# Altium schematic sheet PicoZed.SchDoc
size A4; Organization: Altium Limited; Address1: L3, 12a Rodborough Rd; Address2: Frenchs Forest; Address3: NSW; Address4: Australia 2086; DocumentNumber: 2; SheetNumber: 2; SheetTotal: 2
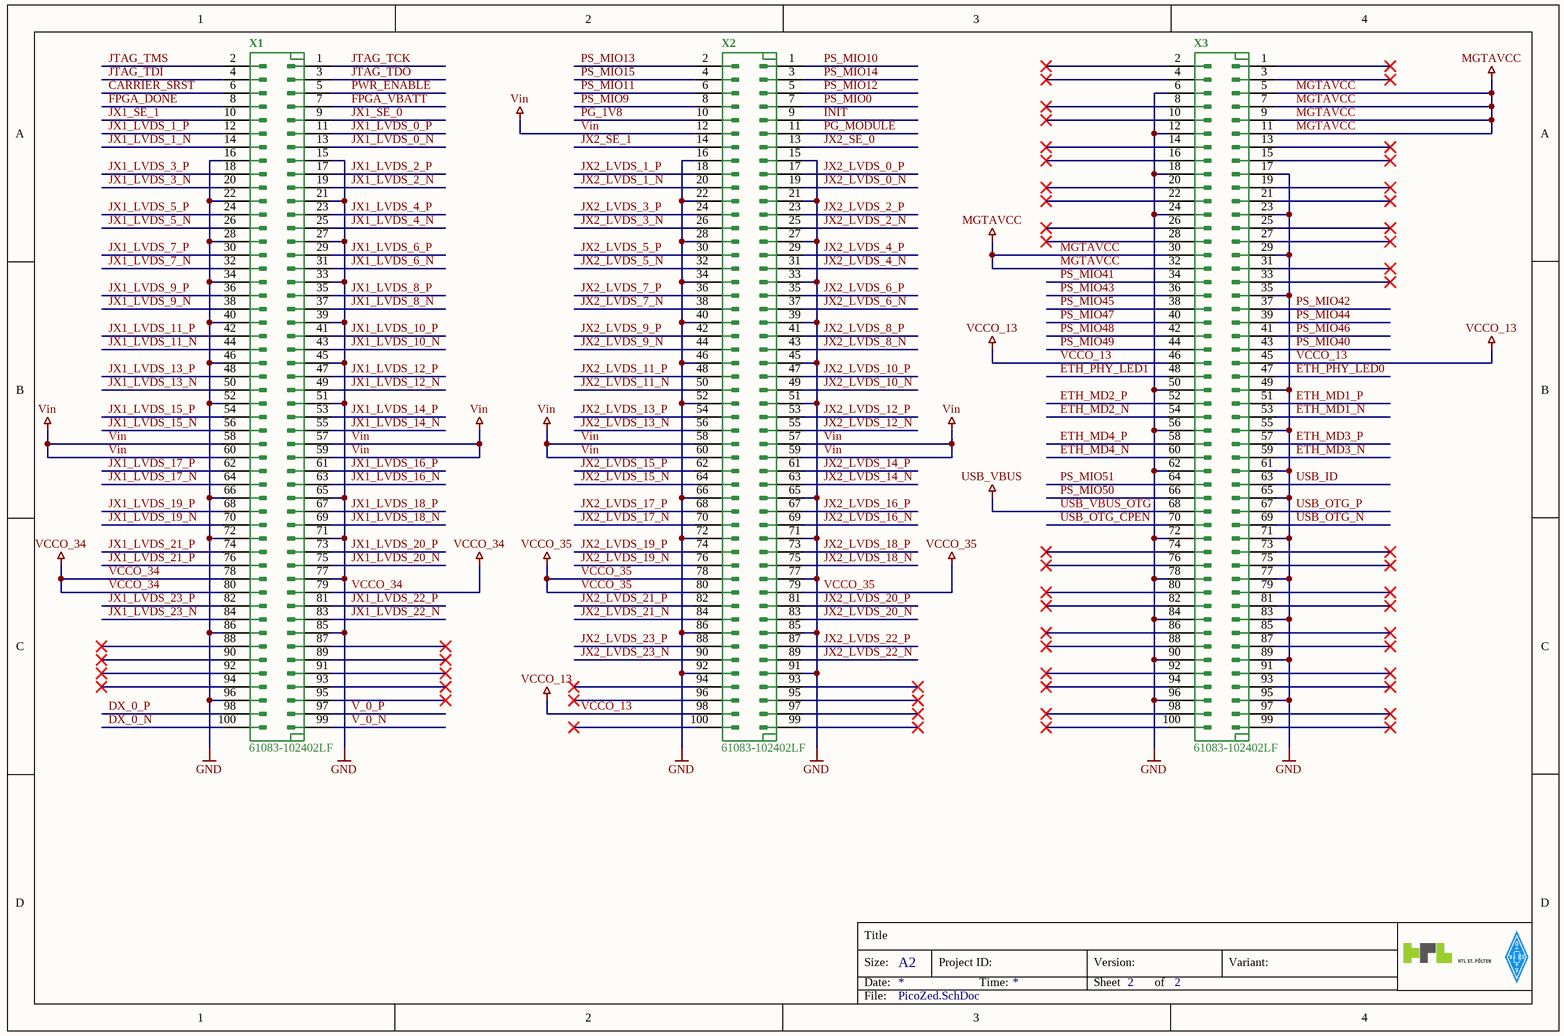
[diagram p0: PicoZed.SchDoc]

## Parts
X1  61083-102402LF  [61083-102402LF]
X2  61083-102402LF  [61083-102402LF]
X3  61083-102402LF  [61083-102402LF]

## Nets
GND: X1.15 X1.16 X1.21 X1.22 X1.27 X1.28 X1.33 X1.34 X1.39 X1.40 X1.45 X1.46 X1.51 X1.52 X1.65 X1.66 X1.71 X1.72 X1.77 X1.85 X1.86 X1.96 X2.15 X2.16 X2.21 X2.22 X2.27 X2.28 X2.33 X2.34 X2.39 X2.40 X2.45 X2.46 X2.51 X2.52 X2.65 X2.66 X2.71 X2.72 X2.77 X2.85 X2.86 X2.91 X2.92 X3.6 X3.12 X3.17 X3.18 X3.23 X3.24 X3.29 X3.35 X3.49 X3.50 X3.55 X3.56 X3.61 X3.62 X3.65 X3.71 X3.72 X3.77 X3.78 X3.83 X3.84 X3.89 X3.90 X3.95 X3.96
MGTAVCC: X3.5 X3.7 X3.9 X3.11 X3.30 X3.32
USB_VBUS: X3.68
VCCO_13: X2.98 X3.45 X3.46
VCCO_34: X1.78 X1.79 X1.80
VCCO_35: X2.78 X2.79 X2.80
Vin: X1.57 X1.58 X1.59 X1.60 X2.12 X2.57 X2.58 X2.59 X2.60
~{CARRIER_SRS}T: X1.6
~{INI}T: X2.9
DX_0_N: X1.100
DX_0_P: X1.98
ETH_MD1_N: X3.53
ETH_MD1_P: X3.51
ETH_MD2_N: X3.54
ETH_MD2_P: X3.52
ETH_MD3_N: X3.59
ETH_MD3_P: X3.57
ETH_MD4_N: X3.60
ETH_MD4_P: X3.58
ETH_PHY_LED0: X3.47
ETH_PHY_LED1: X3.48
FPGA_DONE: X1.8
FPGA_VBATT: X1.7
JTAG_TCK: X1.1
JTAG_TDI: X1.4
JTAG_TDO: X1.3
JTAG_TMS: X1.2
JX1_LVDS_0_N: X1.13
JX1_LVDS_0_P: X1.11
JX1_LVDS_1_N: X1.14
JX1_LVDS_1_P: X1.12
JX1_LVDS_2_N: X1.19
JX1_LVDS_2_P: X1.17
JX1_LVDS_3_N: X1.20
JX1_LVDS_3_P: X1.18
JX1_LVDS_4_N: X1.25
JX1_LVDS_4_P: X1.23
JX1_LVDS_5_N: X1.26
JX1_LVDS_5_P: X1.24
JX1_LVDS_6_N: X1.31
JX1_LVDS_6_P: X1.29
JX1_LVDS_7_N: X1.32
JX1_LVDS_7_P: X1.30
JX1_LVDS_8_N: X1.37
JX1_LVDS_8_P: X1.35
JX1_LVDS_9_N: X1.38
JX1_LVDS_9_P: X1.36
JX1_LVDS_10_N: X1.43
JX1_LVDS_10_P: X1.41
JX1_LVDS_11_N: X1.44
JX1_LVDS_11_P: X1.42
JX1_LVDS_12_N: X1.49
JX1_LVDS_12_P: X1.47
JX1_LVDS_13_N: X1.50
JX1_LVDS_13_P: X1.48
JX1_LVDS_14_N: X1.55
JX1_LVDS_14_P: X1.53
JX1_LVDS_15_N: X1.56
JX1_LVDS_15_P: X1.54
JX1_LVDS_16_N: X1.63
JX1_LVDS_16_P: X1.61
JX1_LVDS_17_N: X1.64
JX1_LVDS_17_P: X1.62
JX1_LVDS_18_N: X1.69
JX1_LVDS_18_P: X1.67
JX1_LVDS_19_N: X1.70
JX1_LVDS_19_P: X1.68
JX1_LVDS_20_N: X1.75
JX1_LVDS_20_P: X1.73
JX1_LVDS_21_P: X1.74 X1.76
JX1_LVDS_22_N: X1.83
JX1_LVDS_22_P: X1.81
JX1_LVDS_23_N: X1.84
JX1_LVDS_23_P: X1.82
JX1_SE_0: X1.9
JX1_SE_1: X1.10
JX2_LVDS_0_N: X2.19
JX2_LVDS_0_P: X2.17
JX2_LVDS_1_N: X2.20
JX2_LVDS_1_P: X2.18
JX2_LVDS_2_N: X2.25
JX2_LVDS_2_P: X2.23
JX2_LVDS_3_N: X2.26
JX2_LVDS_3_P: X2.24
JX2_LVDS_4_N: X2.31
JX2_LVDS_4_P: X2.29
JX2_LVDS_5_N: X2.32
JX2_LVDS_5_P: X2.30
JX2_LVDS_6_N: X2.37
JX2_LVDS_6_P: X2.35
JX2_LVDS_7_N: X2.38
JX2_LVDS_7_P: X2.36
JX2_LVDS_8_N: X2.43
JX2_LVDS_8_P: X2.41
JX2_LVDS_9_N: X2.44
JX2_LVDS_9_P: X2.42
JX2_LVDS_10_N: X2.49
JX2_LVDS_10_P: X2.47
JX2_LVDS_11_N: X2.50
JX2_LVDS_11_P: X2.48
JX2_LVDS_12_N: X2.55
JX2_LVDS_12_P: X2.53
JX2_LVDS_13_N: X2.56
JX2_LVDS_13_P: X2.54
JX2_LVDS_14_N: X2.63
JX2_LVDS_14_P: X2.61
JX2_LVDS_15_N: X2.64
JX2_LVDS_15_P: X2.62
JX2_LVDS_16_N: X2.69
JX2_LVDS_16_P: X2.67
JX2_LVDS_17_N: X2.70
JX2_LVDS_17_P: X2.68
JX2_LVDS_18_N: X2.75
JX2_LVDS_18_P: X2.73
JX2_LVDS_19_N: X2.76
JX2_LVDS_19_P: X2.74
JX2_LVDS_20_N: X2.83
JX2_LVDS_20_P: X2.81
JX2_LVDS_21_N: X2.84
JX2_LVDS_21_P: X2.82
JX2_LVDS_22_N: X2.89
JX2_LVDS_22_P: X2.87
JX2_LVDS_23_N: X2.90
JX2_LVDS_23_P: X2.88
JX2_SE_0: X2.13
JX2_SE_1: X2.14
PG_1V8: X2.10
PG_MODULE: X2.11
PS_MIO0: X2.7
PS_MIO9: X2.8
PS_MIO10: X2.1
PS_MIO11: X2.6
PS_MIO12: X2.5
PS_MIO13: X2.2
PS_MIO14: X2.3
PS_MIO15: X2.4
PS_MIO40: X3.43
PS_MIO41: X3.34
PS_MIO42: X3.37
PS_MIO43: X3.36
PS_MIO44: X3.39
PS_MIO45: X3.38
PS_MIO46: X3.41
PS_MIO47: X3.40
PS_MIO48: X3.42
PS_MIO49: X3.44
PS_MIO50: X3.66
PS_MIO51: X3.64
PWR_ENABLE: X1.5
USB_ID: X3.63
USB_OTG_CPEN: X3.70
USB_OTG_N: X3.69
USB_OTG_P: X3.67
V_0_N: X1.99
V_0_P: X1.97

Not connected (* = marked no-connect by the designer): X1 87* 88* 89* 90* 91* 92* 93* 94* 95*; X2 93* 94* 95* 96* 97* 99* 100*; X3 1* 2* 3* 4* 8* 10* 13* 14* 15* 16* 19* 20* 21* 22* 25* 26* 27* 28* 31* 33* 73* 74* 75* 76* 79* 80* 81* 82* 85* 86* 87* 88* 91* 92* 93* 94* 97* 98* 99* 100*

## Notes on the sheet
- (near X3) MGTAVCC
- Vin
- MGTAVCC
- VCCO_13
- (near X3) VCCO_13
- (near X1) Vin
- (near X2) Vin
- USB_VBUS_OTG
- VCCO_34
- VCCO_35
- (near X1) VCCO_34
- (near X2) VCCO_35
- Title
- Size:
- Date:
- A2
- Project ID:
- Time:
- Sheet
- Version:
- of
- Variant:
- File:

## Library data of the parts
X1-X3 = X_61083-102402LF: Bergstark® Plug 2x50 - Pin / Pitch: 0.8mm / Heighth: 11.7mm / Gold plated with polarization pegs /; Prometheus_Manufacturer: Amphenol ICC; Prometheus_ID: *; Prometheus_ManPartNo: 61083-102402LF; Prometheus_Comment: 61083-102402LF; Prometheus_CurrentFootprint: 61083-102402LF